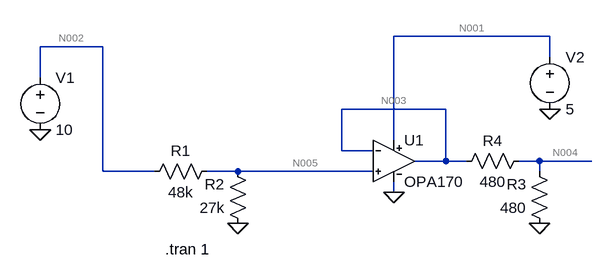
[diagram p0: schematic AnalogIN_OPA170.asc]
AnalogIN_OPA170.asc, the LTspice schematic file:
Version 4
SHEET 1 880 680
WIRE 416 -16 176 -16
WIRE -272 0 -368 0
WIRE 416 16 416 -16
WIRE -368 48 -368 0
WIRE 256 96 96 96
WIRE 176 144 176 -16
WIRE 96 160 96 96
WIRE 144 160 96 160
WIRE 256 176 256 96
WIRE 256 176 208 176
WIRE 288 176 256 176
WIRE 400 176 368 176
WIRE 480 176 400 176
WIRE -272 192 -272 0
WIRE -192 192 -272 192
WIRE -64 192 -112 192
WIRE 144 192 -64 192
WIRE 400 192 400 176
WIRE 176 224 176 208
FLAG -64 272 0
FLAG 400 272 0
FLAG 176 224 0
FLAG 416 96 0
FLAG -368 128 0
SYMBOL res -96 176 R90
WINDOW 0 0 56 VBottom 2
WINDOW 3 32 56 VTop 2
SYMATTR InstName R1
SYMATTR Value 48k
SYMBOL res -48 288 R180
WINDOW 0 36 76 Left 2
WINDOW 3 36 40 Left 2
SYMATTR InstName R2
SYMATTR Value 27k
SYMBOL res 416 288 R180
WINDOW 0 36 76 Left 2
WINDOW 3 36 40 Left 2
SYMATTR InstName R3
SYMATTR Value 480
SYMBOL res 272 192 R270
WINDOW 0 32 56 VTop 2
WINDOW 3 0 56 VBottom 2
SYMATTR InstName R4
SYMATTR Value 480
SYMBOL voltage -368 32 R0
WINDOW 123 0 0 Left 2
WINDOW 39 0 0 Left 2
SYMATTR InstName V1
SYMATTR Value 10
SYMBOL voltage 416 0 R0
WINDOW 123 0 0 Left 2
WINDOW 39 0 0 Left 2
SYMATTR InstName V2
SYMATTR Value 5
SYMBOL OPA170 176 112 R0
SYMATTR InstName U1
TEXT -176 312 Left 2 !.tran 1

The netlist it stands for:
* AnalogIN_OPA170.asc
R1 N005 N002 48k
R2 0 N005 27k
R3 0 N004 480
R4 N003 N004 480
V1 N002 0 10
V2 N001 0 5
XU1 N003 N005 0 N001 N003 OPA170  ; pins In- In+ V- V+ OUT
.tran 1
.lib OPA170.sub
.backanno
.end

* Results of the author's LTspice run, read from the files saved beside the schematic
* Operating Point, zero values left out:
*   V(n005) = 3.6 V
*   V(n002) = 10 V
*   V(n004) = 1.744 V
*   V(n003) = 3.488 V
*   V(n001) = 5 V
*   I(R4) = 3.633 mA
*   I(R3) = -3.633 mA
*   I(R2) = -133.3 µA
*   I(R1) = -133.3 µA
*   I(V2) = -5 kA
*   I(V1) = -133.3 µA
*   Ix(u1:-IN) = -1.465 pA
*   Ix(u1:+IN) = -5.224 pA
*   Ix(u1:V-) = -5 kA
*   Ix(u1:V+) = 5 kA
*   Ix(u1:VOUT) = -3.633 mA
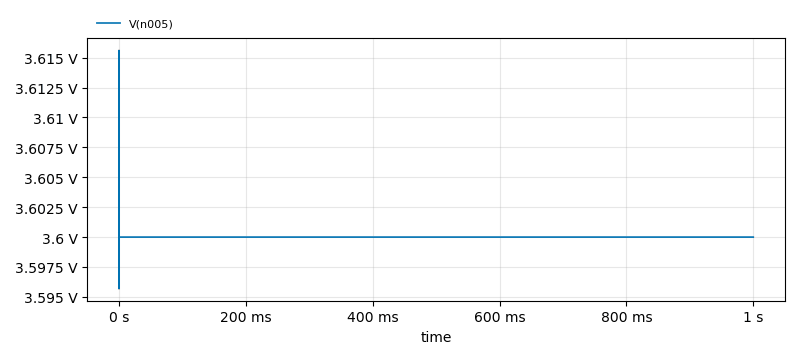
[diagram p1: Transient Analysis of AnalogIN_OPA170.asc, plotted from the saved traces]
* Transient Analysis, 1 run:
*   V(n005): min 3.596 V, max 3.616 V, average 3.6 V, rms 3.6 V, last 3.6 V